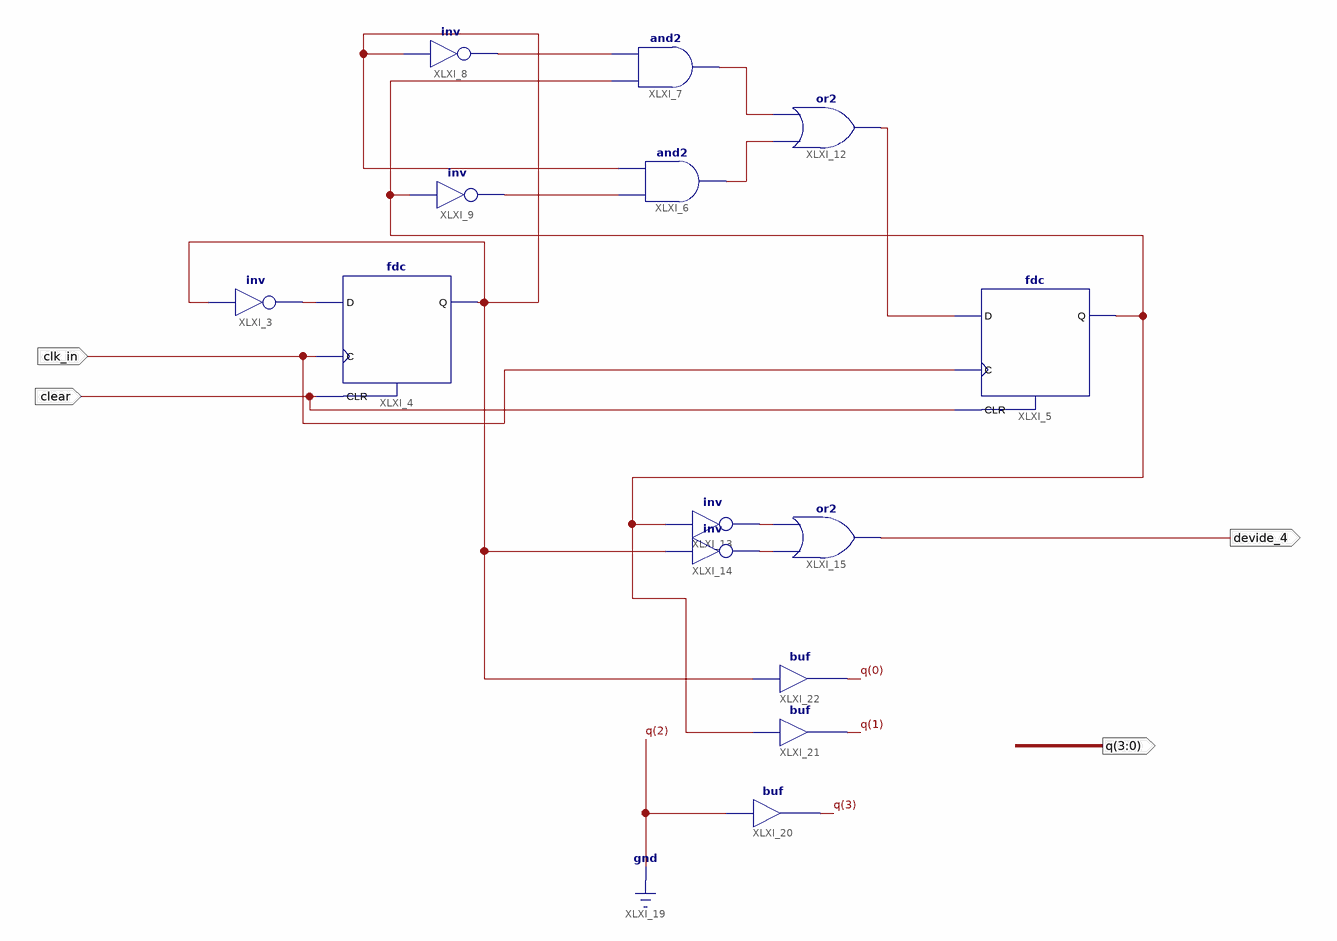
[diagram p0: schematic sheet 1]
// Xilinx ISE schematic counter03.sch (spartan6) as structural Verilog: 14 symbols, 4 ports
module counter03 (
  input  clear,
  input  clk_in,
  output devide_4,
  output [3:0] q
);

  wire XLXN_1, XLXN_3, XLXN_6, XLXN_7, XLXN_10, XLXN_11, XLXN_12, XLXN_16, XLXN_18, XLXN_19;

  not XLXI_3 (XLXN_1, XLXN_3);
  fdc XLXI_4 (.C(clk_in), .CLR(clear), .D(XLXN_1), .Q(XLXN_3));
  fdc XLXI_5 (.C(clk_in), .CLR(clear), .D(XLXN_12), .Q(XLXN_16));
  and XLXI_7 (XLXN_10, XLXN_16, XLXN_6);
  not XLXI_8 (XLXN_6, XLXN_3);
  and XLXI_6 (XLXN_11, XLXN_7, XLXN_3);
  not XLXI_9 (XLXN_7, XLXN_16);
  or XLXI_12 (XLXN_12, XLXN_11, XLXN_10);
  or XLXI_15 (devide_4, XLXN_19, XLXN_18);
  not XLXI_13 (XLXN_18, XLXN_16);
  not XLXI_14 (XLXN_19, XLXN_3);
  buf XLXI_20 (q[3], 1'b0);
  buf XLXI_21 (q[1], XLXN_16);
  buf XLXI_22 (q[0], XLXN_3);

  assign q[2] = 1'b0;
endmodule
